# EAGLE design FinishLine (EAGLE 9.6.2)
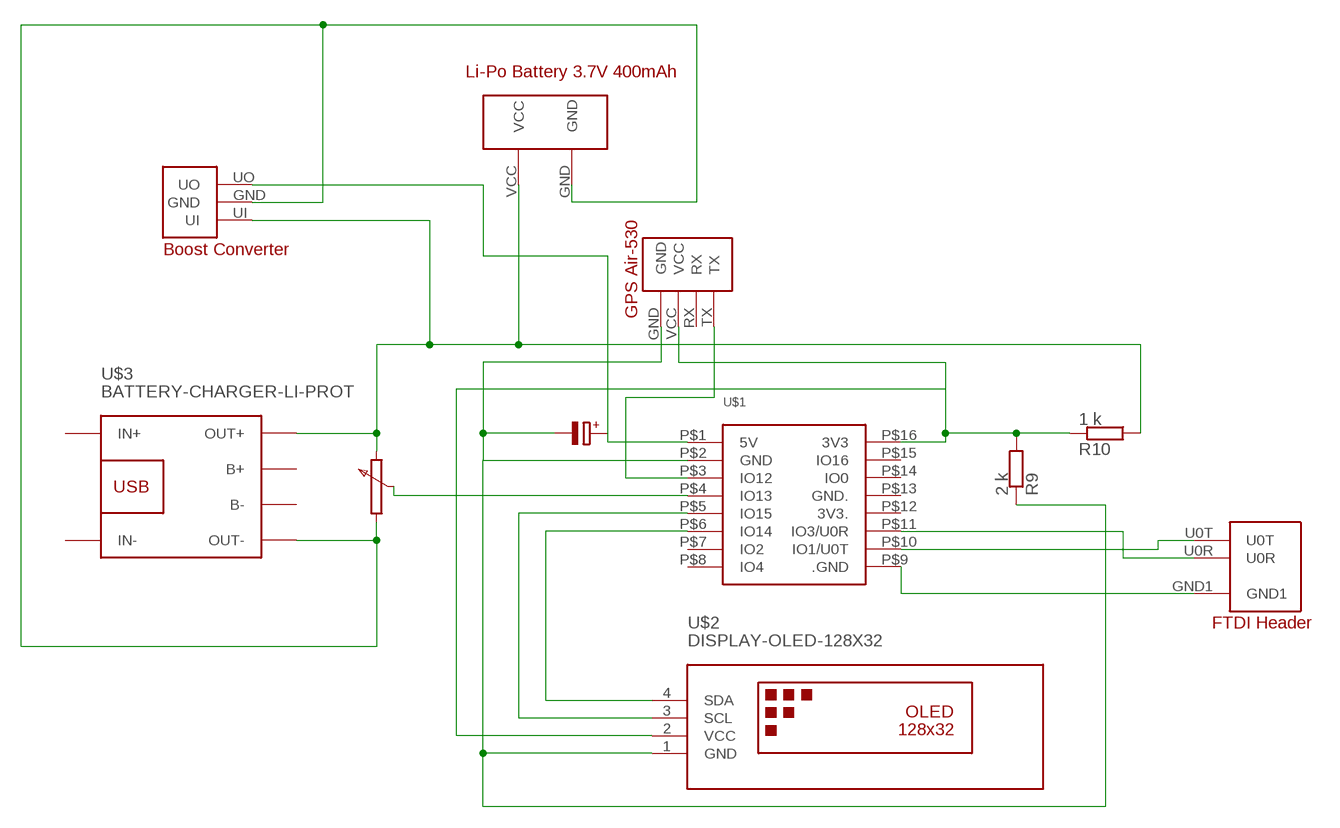
[diagram p0: schematic, sheet 1]

## Parts
R9  2 k  SMT-REF  [SMT-REF]
R10  1 k  SMT-REF  [SMT-REF]
U$1  ESP32-CAM  [ESP32-CAM]
U$2  DISPLAY-OLED-128X32  [DISPLAY-OLED-128X32]
U$3  BATTERY-CHARGER-LI-PROT  [BATTERY-CHARGER-LI-PROT]
U$4  GPS  [GPS]
U$5  BOOST_CONVERTER  [BOOST_CONVERTER]
U$6  LIPO_BAT  [LIPO_BAT]
U$7  HEADER_FTDI  [HEADER_FTDI]

## Nets
N$1: U$1.P$6(IO14) U$2.4(SDA)
N$2: U$1.P$5(IO15) U$2.3(SCL)
N$3: U$1.P$4(IO13)
N$4: R9.2 U$1.P$2(GND) U$2.1(GND) U$4.GND
N$5: R9.1 R10.2 U$1.P$16(3V3) U$2.2(VCC) U$4.VCC
N$6: R10.1 U$3.OUT+ U$5.UI U$6.VCC
N$7: U$3.OUT- U$5.GND U$6.GND
N$8: U$1.P$1(5V) U$5.UO
N$9: U$1.P$9(.GND) U$7.GND1
N$10: U$1.P$11(IO3/U0R) U$7.U0R
N$11: U$1.P$10(IO1/U0T) U$7.U0T
N$12: U$1.P$3(IO12) U$4.TX
Unconnected: U$1.P$7(IO2) U$1.P$8(IO4) U$1.P$12(3V3.) U$1.P$13(GND.) U$1.P$14(IO0) U$1.P$15(IO16) U$3.B+ U$3.B- U$3.IN+ U$3.IN- U$4.RX

## Library data of the parts
R9 R10 = resistor-shunt:SMT-REF: SMD SHUNT RESISTOR; OC_FARNELL: unknown; OC_NEWARK: unknown
U$1 = ESP32-CAM:ESP32-CAM: Check prices <https://pricing.snapeda.com/parts/ESP32-CAM/AI-Thinker/view-part?ref=eda>; AVAILABILITY: No availability data; DESCRIPTION: ESP32 ESP32 Transceiver; 802.11 a/b/g/n (Wi-Fi, WiFi, WLAN), Bluetooth® Smart 4.x Low Energy (BLE) Evaluation Board; MF: AI-Thinker; MP: ESP32-CAM; PACKAGE: Package; PRICE: None
U$2 = diy-modules (1):DISPLAY-OLED-128X32: 128x32 Dot Matrix OLED Module with I2C interface based on SSD1306 chip More details available here: http://www.tinyosshop.com/index.php?route=product/product&product_id=953 Schematic available here: http://www.tinyosshop.com/datasheet/OLED%2012832.pdf SSD1306 datasheet: https://cdn-shop.adafruit.com/datasheets/SSD1306.pdf Click here to find device on ebay.com <http://www.ebay.com/sch/oled+display+128x32+i2c>
U$3 = diy-modules (1):BATTERY-CHARGER-LI-PROT: Lithium Battery 5V Charger with protection circuit More details available here: http://www.instructables.com/id/DIY-Lithium-ion-Battery-Charger/step4/TP4056-based-lithium-ion-battery-charger-module/ Click here to find device on ebay.com <http://www.ebay.com/sch/tp4056+charger+usb+protection>
U$4 = ESP32:GPS
U$5 = ESP32:BOOST_CONVERTER
U$6 = ESP32:LIPO_BAT
U$7 = ESP32:HEADER_FTDI

## Board
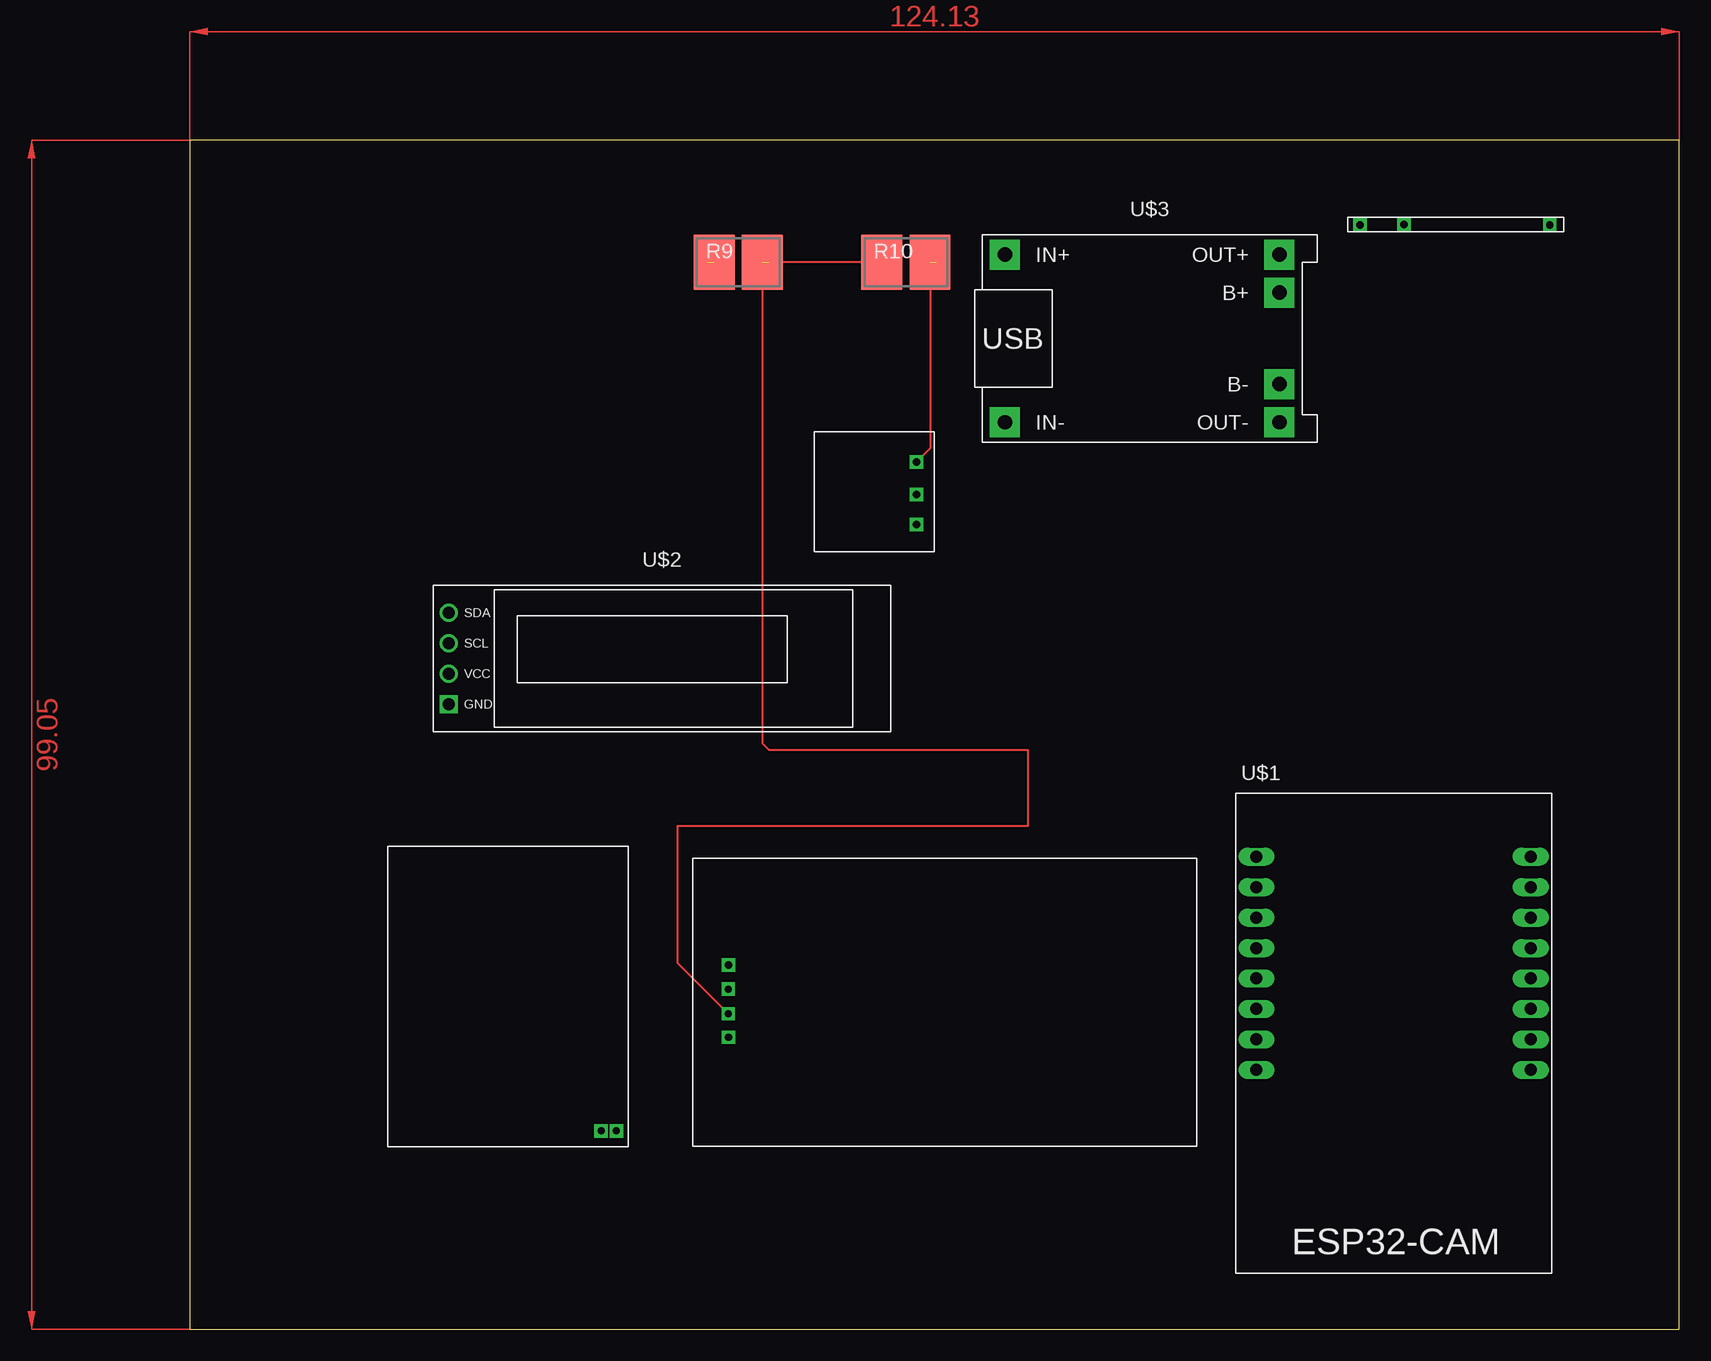
[diagram p1: board, top side]
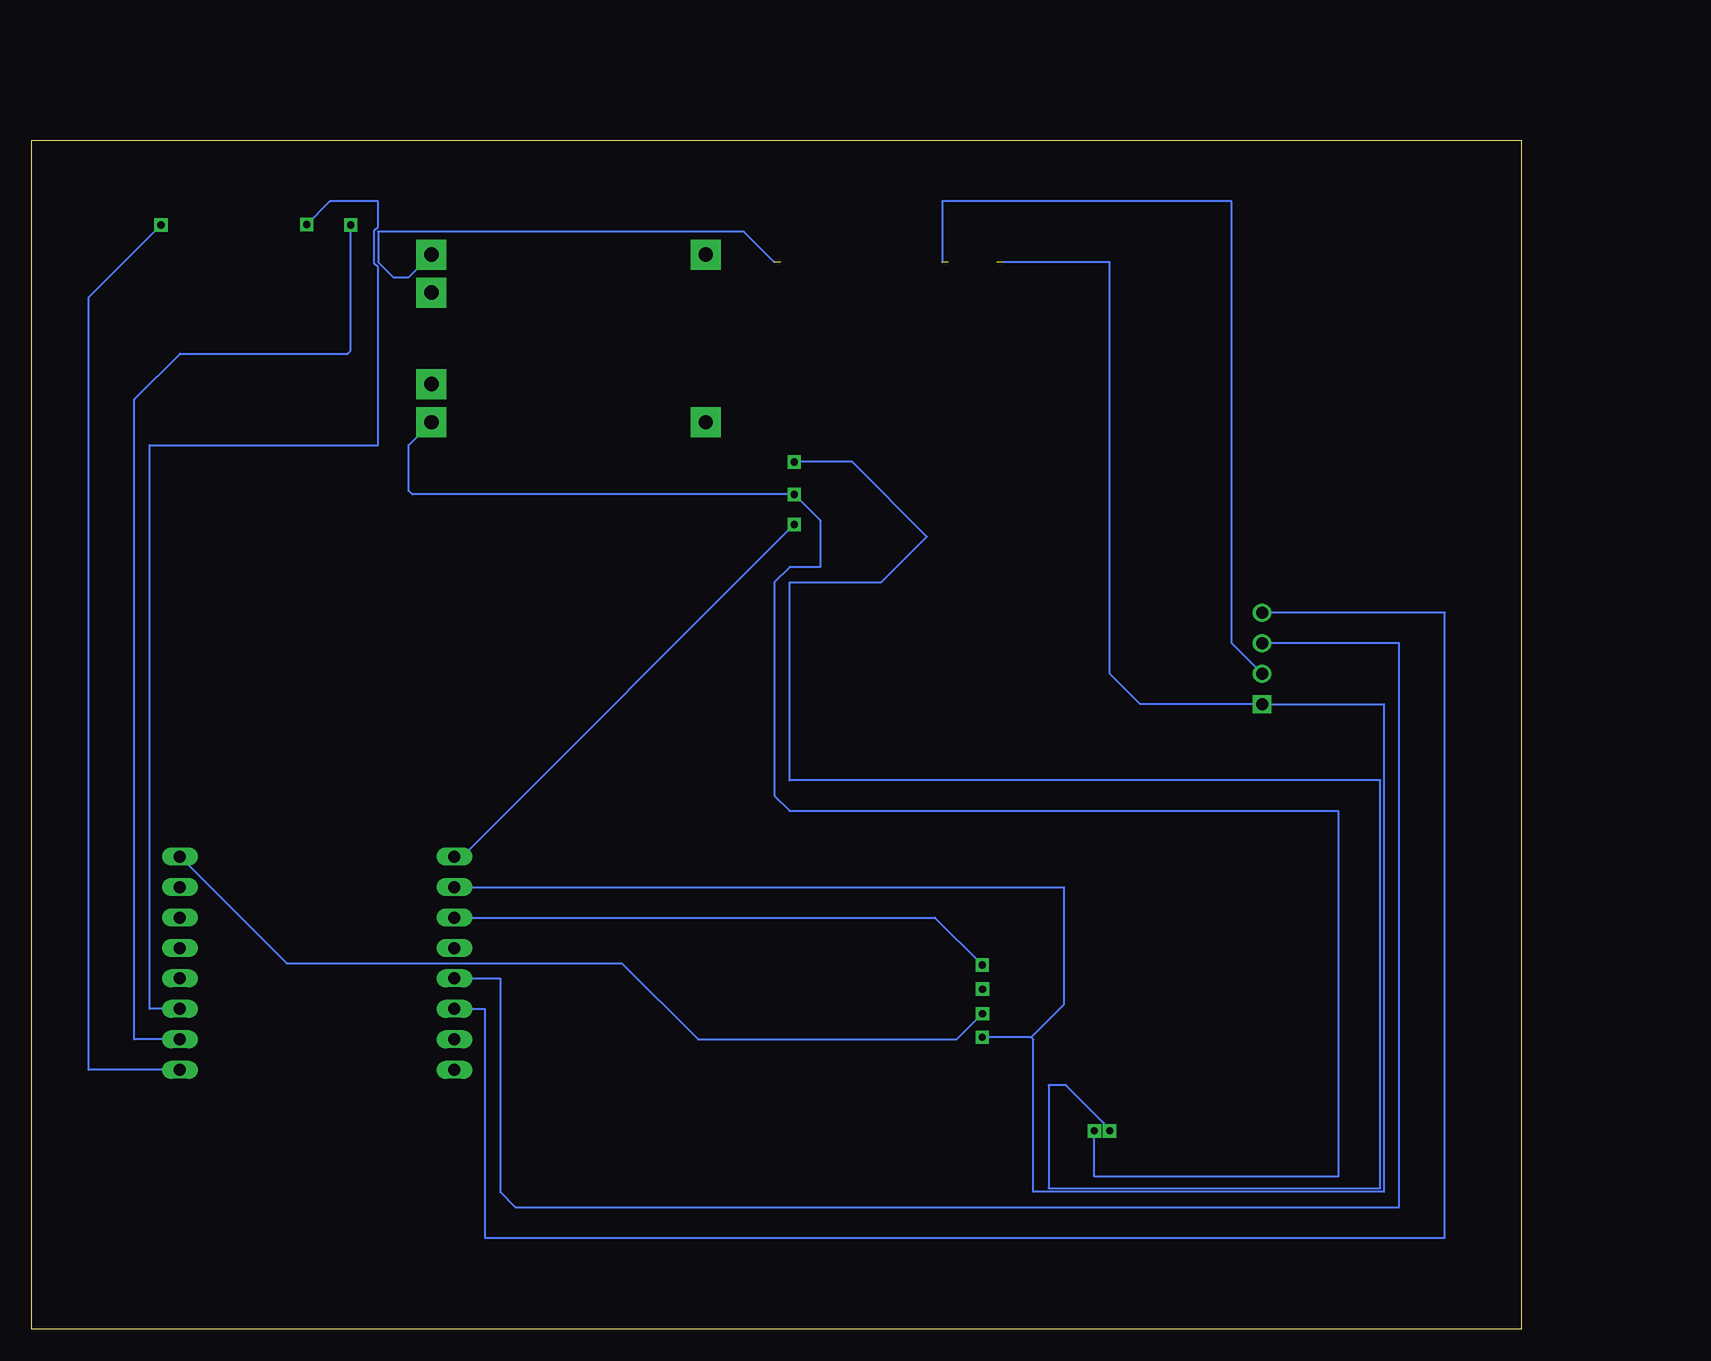
[diagram p2: board, bottom side, seen from below]

Size 124.13 x 99.05 mm. Coordinates in mm from the lower left corner, seen from the top.
Outline: 0,0 124.13,0 124.13,99.05 0,99.05 0,0
Copper layers (1*16): Top 0.035mm / dielectric 1.5mm / Bottom 0.035mm
Design rules "default": minimum track width 6mil, minimum drill 0.35mm, track to track 6mil, track to pad 6mil, pad to pad 6mil, via to via 6mil, smd to smd 6mil, copper to edge 40mil, drill to drill 6mil, minimum pad ring 10mil, minimum via ring 8mil, stop-mask expansion 4mil, vias tented up to drill 0mil, thermal gap 10mil

### Footprints (pad centres in the part's own frame; a part is rotated, then mirrored left to right if it is on the bottom)
SMT-REF = smd 3.4 x 4.6: 1 2.007,0; 2 -2.007,0
ESP32-CAM = drill 1 pad 1.422 long: P$1 -11.43,10.16; P$2 -11.43,7.62; P$3 -11.43,5.08; P$4 -11.43,2.54; P$5 -11.43,0; P$6 -11.43,-2.54; P$7 -11.43,-5.08; P$8 -11.43,-7.62; P$9 11.43,-7.62; P$10 11.43,-5.08; P$11 11.43,-2.54; P$12 11.43,0; P$13 11.43,2.54; P$14 11.43,5.08; P$15 11.43,7.62; P$16 11.43,10.16
DISPLAY-OLED-128X32 = drill 1 square: 1 -17.78,-3.81 | drill 1: 2 -17.78,-1.27; 3 -17.78,1.27; 4 -17.78,3.81
BATTERY-CHARGER-LI-PROT = drill 1.2 pad 2.5 square: B+ 10.795,3.81; B- 10.795,-3.81; IN+ -12.065,6.985; IN- -12.065,-6.985; OUT+ 10.795,6.985; OUT- 10.795,-6.985
GPS = drill 0.6 square: GND 2.988,9.073; RX 2.973,13.084; TX 2.988,15.1; VCC 2.98,11.034
BOOST_CONVERTER = drill 0.6 square: GND 8.504,4.774; UI 8.504,7.484; UO 8.504,2.28
LIPO_BAT = drill 0.6 square: GND 19.05,1.27; VCC 17.78,1.27
HEADER_FTDI = drill 0.6 square: GND1 16.822,0.568; U0R 4.683,0.597; U0T 1.014,0.568

### Placement (x,y rotation side)
R9  45.72,88.9 0 top
R10  59.69,88.9 0 top
U$1  100.33,29.21 0 top
U$2  39.37,55.88 0 top
U$3  80.01,82.55 0 top
U$4  41.91,15.24 0 top
U$5  52.07,64.77 0 top
U$6  16.51,15.24 0 top
U$7  96.52,91.44 0 top

### Tracks (layer width: path | path; a pad name or v marks a point on that pad's centre or on a via)
N$1
  Bottom 0.152: U$1.P$6 86.36,26.67 86.36,7.62 6.35,7.62 6.35,59.69 U$2.4
N$2
  Bottom 0.152: U$1.P$5 85.09,29.21 85.09,11.43 83.82,10.16 10.16,10.16 10.16,57.15 U$2.3
N$4  (1 unrouted)
  Bottom 0.152: 43.18,88.9 34.29,88.9 34.29,54.61 31.75,52.07 U$2.1 11.43,52.07 11.43,11.43 40.64,11.43 40.64,24.13 40.82,24.31 | 40.82,24.31 U$4.GND | U$1.P$2 38.1,36.83 38.1,27.04 40.82,24.31
N$5  (1 unrouted)
  Top 0.152: R10.2 R9.1 47.73,48.79 48.26,48.26 69.85,48.26 69.85,41.91 40.64,41.91 40.64,30.52 U$4.VCC
  Bottom 0.152: U$1.P$16 102.87,30.48 74.93,30.48 68.58,24.13 47.04,24.13 U$4.VCC | U$2.2 24.13,57.15 24.13,93.98 48.26,93.98 48.26,88.9
N$6  (1 unrouted)
  Top 0.152: R10.1 61.7,73.38 U$5.UI
  Bottom 0.152: U$6.VCC 34.78,17 34.78,17.16 37.94,20.32 39.37,20.32 39.37,11.74 11.73,11.74 11.73,45.72 60.96,45.72 60.96,62.23 53.34,62.23 49.53,66.04 55.74,72.25 U$5.UI | 62.23,88.9 64.77,91.44 95.25,91.44 95.25,88.9 93.98,87.63 92.71,87.63 U$3.OUT+
N$7
  Bottom 0.152: U$3.OUT- 92.71,73.66 92.71,69.85 92.4,69.54 U$5.GND 58.42,67.39 58.42,63.5 60.96,63.5 62.23,62.23 62.23,44.45 60.96,43.18 15.24,43.18 15.24,12.7 35.56,12.7 U$6.GND
N$8
  Bottom 0.152: U$5.UO 88.25,39.37 U$1.P$1
N$9
  Bottom 0.152: U$1.P$9 119.38,21.59 119.38,85.97 U$7.GND1
N$10
  Bottom 0.152: U$1.P$11 114.3,26.67 114.3,73.66 95.25,73.66 95.25,88.47 95.55,88.77 95.55,91.57 95.25,91.87 95.25,93.98 99.26,93.98 U$7.U0R
N$11
  Bottom 0.152: U$1.P$10 115.57,24.13 115.57,77.47 111.76,81.28 97.79,81.28 97.53,81.54 U$7.U0T
N$12
  Bottom 0.152: U$1.P$3 48.85,34.29 U$4.TX
(copper drawn outside any net)
  shapes: Top area x2